# EAGLE design FTDI (EAGLE 5.06)
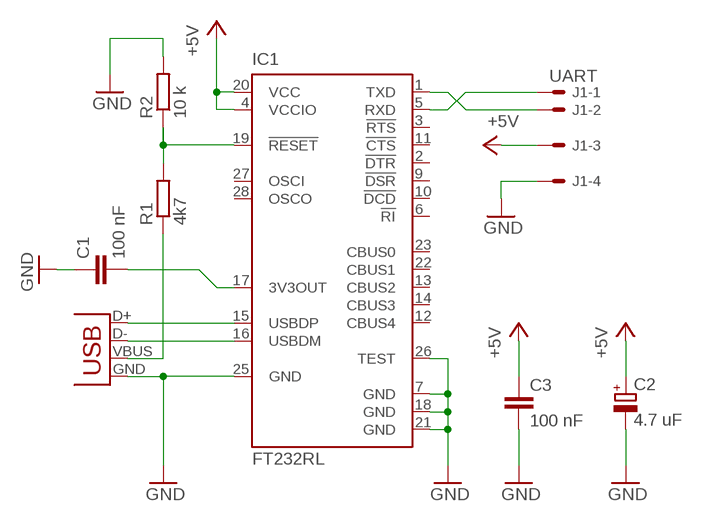
[diagram p0: schematic, sheet 1]

## Parts
C1  100 nF  C-EU050-024X044  [C050-024X044]
C2  4.7 uF  CPOL-EUE5-4  [E5-4]
C3  100 nF  C-EU050-024X044  [C050-024X044]
IC1  FT232RL  [SSOP28]
J1  UART  22-27-2041-04  [6410-04]
R1  4k7  R-EU_0207/10  [0207/10]
R2  10 k  R-EU_0207/10  [0207/10]
X1  USB  USBPTH  [USB-B-PTH]

## Nets
+5V: C2.+ C3.1 IC1.4(VCCIO) IC1.20(VCC) J1.3
GND: C1.1 C2.- C3.2 IC1.7(GND) IC1.18(GND) IC1.21(GND) IC1.25(GND) IC1.26(TEST) J1.4 R2.2 X1.GND
N$1: IC1.1(TXD) J1.2
N$2: IC1.15(USBDP) X1.D+
N$3: IC1.16(USBDM) X1.D-
N$4: R1.1 X1.VBUS
N$5: IC1.5(RXD) J1.1
N$9: C1.2 IC1.17(3V3OUT)
N$11: IC1.19(!RESET) R1.2 R2.1
Unconnected: IC1.2(!DTR) IC1.3(!RTS) IC1.6(!RI) IC1.9(!DSR) IC1.10(!DCD) IC1.11(!CTS) IC1.12(CBUS4) IC1.13(CBUS2) IC1.14(CBUS3) IC1.22(CBUS1) IC1.23(CBUS0) IC1.27(OSCI) IC1.28(OSCO)

## Library data of the parts
C1 C3 = rcl:C-EU: CAPACITOR, European symbol
C2 = rcl:CPOL-EU: POLARIZED CAPACITOR, European symbol
IC1 = ftdichip:FT232R: Source: http://www.ftdichip.com/Documents/DataSheets/DS_FT232R_v104.pdf
J1 = con-molex:22-?-04: CONNECTOR wire to board 2.54 mm (.1 inch) pitch header
R1 R2 = rcl:R-EU_: RESISTOR, European symbol
X1 = SparkFun:USB: USB Connectors USB-B-PTH is fully proven SKU : PRT-00139 USB-miniB is fully proven SKU : PRT-00587 USB-A-PCB is untested. USB-A-H is throughly reviewed, but untested. Spark Fun Electronics SKU : PRT-00437 USB-B-SMT is throughly reviewed, but untested. Needs silkscreen touching up. USB-A-S has not been used/tested USB-MB-H has not been used/tested

## Board
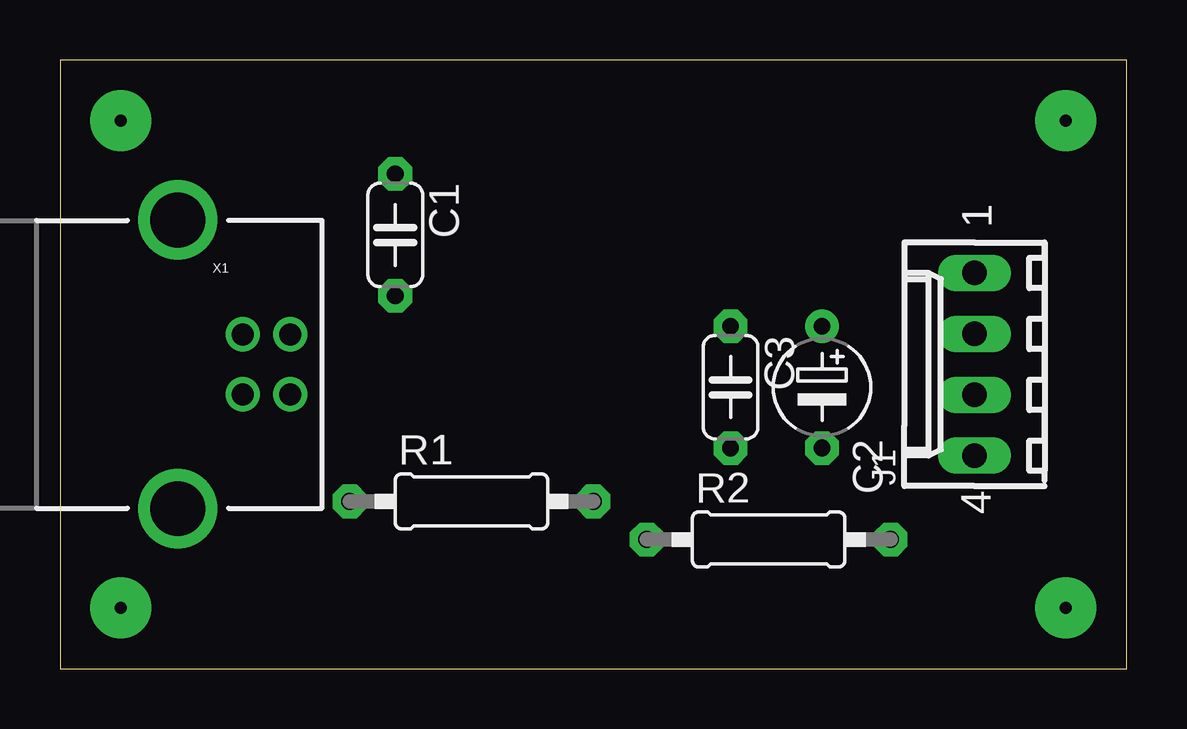
[diagram p1: board, top side]
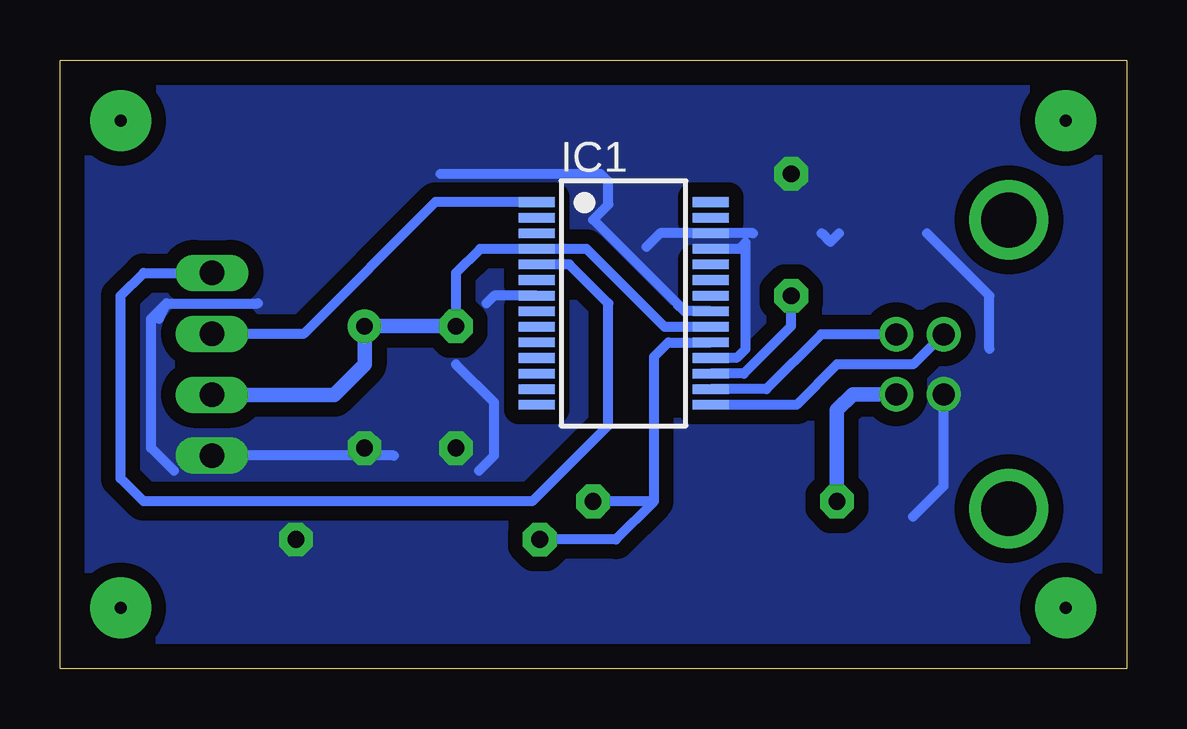
[diagram p2: board, bottom side, seen from below]

Size 44.44 x 25.39 mm. Coordinates in mm from the lower left corner, seen from the top.
Outline: 0,0 44.44,0 44.44,25.39 0,25.39 0,0
Copper layers (1*16): Top 0.035mm / dielectric 1.5mm / Bottom 0.035mm
Design rules "default": minimum track width 10mil, minimum drill 24mil, track to track 8mil, track to pad 8mil, pad to pad 8mil, via to via 8mil, smd to smd 8mil, copper to edge 40mil, drill to drill 8mil, minimum pad ring 10mil, minimum via ring 8mil, stop-mask expansion 4mil, vias tented up to drill 0mil, thermal gap 10mil

### Footprints (pad centres in the part's own frame; a part is rotated, then mirrored left to right if it is on the bottom)
C050-024X044 = drill 0.7 pad 1.4 octagon: 1 -2.54,0; 2 2.54,0
E5-4 = drill 0.7 pad 1.4 round: + -2.54,0 | drill 0.7 pad 1.4 octagon: - 2.54,0
SSOP28 = smd 0.4 x 1.5: 1 -4.225,-3.625; 2 -3.575,-3.625; 3 -2.925,-3.625; 4 -2.275,-3.625; 5 -1.625,-3.625; 6 -0.975,-3.625; 7 -0.325,-3.625; 8 0.325,-3.625; 9 0.975,-3.625; 10 1.625,-3.625; 11 2.275,-3.625; 12 2.925,-3.625; 13 3.575,-3.625; 14 4.225,-3.625; 15 4.225,3.625; 16 3.575,3.625; 17 2.925,3.625; 18 2.275,3.625; 19 1.625,3.625; 20 0.975,3.625; 21 0.325,3.625; 22 -0.325,3.625; 23 -0.975,3.625; 24 -1.625,3.625; 25 -2.275,3.625; 26 -2.925,3.625; 27 -3.575,3.625; 28 -4.225,3.625
6410-04 = drill 1.016 long: 1 3.81,0; 2 1.27,0; 3 -1.27,0; 4 -3.81,0
0207/10 = drill 0.7 pad 1.4 octagon: 1 -5.08,0; 2 5.08,0
USB-B-PTH = drill 0.914 round: D+ 0,1.25; D- 1.981,1.25; GND 0,-1.25; VBUS 1.981,-1.25 | drill 2.286 round: P$1 -2.718,-6.02; P$2 -2.718,6.02

### Placement (x,y rotation side)
C1  13.97,18.1 270 top
C2  31.75,11.75 270 top
C3  27.94,11.75 270 top
IC1  20.95,15.24 270 bottom
J1  38.1,12.7 90 top
R1  17.15,6.98 0 top
R2  29.53,5.4 0 top
X1  7.62,12.7 0 top

### Tracks (layer width: path | path; a pad name or v marks a point on that pad's centre or on a via)
+5V
  Bottom 0.406: IC1.20 19.24,14.26 22.49,17.51 IC1.4 26.93,17.51 27.94,16.51 C3.1
  Bottom 0.61: J1.3 33.02,11.43 31.75,12.7 C2.+ C3.1
GND
  Bottom 0.406: 15.56,18.17 IC1.26 19.44,18.17 20,17.6 | 8.32,18.17 5.71,15.56 5.71,13.36 | 12.7,18.17 12.33,17.8 11.97,18.17 | IC1.18 16.24,12.96 15.88,13.33 15.88,17.78 16.14,17.51 IC1.25 | 30.53,8.89 J1.4 | X1.GND 7.62,7.62 8.89,6.35 | 18.41,14.92 18.73,15.24 | IC1.21 18.41,14.92 | 18.41,14.92 22.23,18.73 21.59,19.37 21.59,20.32 21.91,20.64 28.57,20.64 | 40,15.24 40.32,14.61 | 27.94,12.7 26.35,11.11 26.35,8.89 26.99,8.25 | 39.69,8.25 40.64,9.21 40.64,14.61 40,15.24 | IC1.7 26.34,15.57 26.67,15.24 | 40,15.24 36.2,15.24
  pour Bottom (isolate 0.61, no thermals): 0,25.4 43.5,25.4 43.5,0 0,0
N$1
  Bottom 0.406: IC1.1 28.8,19.46 34.29,13.97 J1.2
N$2
  Bottom 0.406: X1.D+ 7.64,13.95 8.89,12.7 12.06,12.7 13.75,11.01 IC1.15
N$3
  Bottom 0.406: IC1.16 15.01,11.67 12.72,13.95 X1.D-
N$4
  Bottom 0.61: X1.VBUS 11.41,11.45 12.06,10.79 R1.1
N$5
  Bottom 0.406: IC1.5 23.22,16.86 21.59,15.24 21.59,10.16 24.77,6.98 40.96,6.98 41.91,7.94 41.91,15.56 40.96,16.51 J1.1
N$6  (via drill 0.5 pad 2.54)
  other vias: 2.54,22.86
N$7  (via drill 0.5 pad 2.54)
  other vias: 2.54,2.54
N$8  (via drill 0.5 pad 2.54)
  other vias: 41.91,22.86
N$9
  Bottom 0.406: IC1.17 15.94,12.32 13.97,14.29 C1.2
N$10  (via drill 0.5 pad 2.54)
  other vias: 41.91,2.54
N$11
  Bottom 0.406: IC1.19 19.09,13.61 19.69,13.02 19.69,6.98 | 19.69,6.98 21.27,5.4 R2.1 | 19.69,6.98 R1.2